# EAGLE design arduino_adapter (EAGLE 7.3.0)
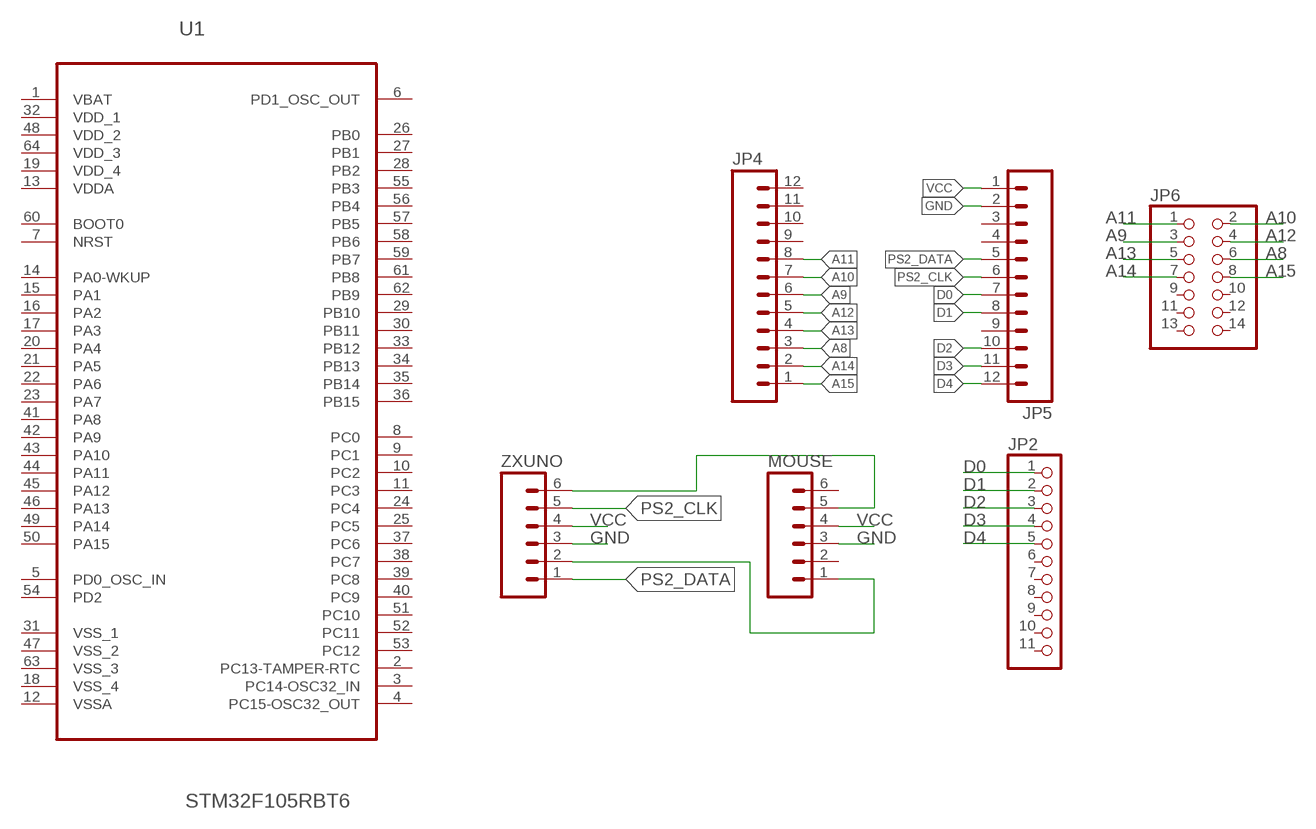
[diagram p0: schematic, sheet 1]

## Parts
JP2  PINHD-1X11  [1X11]
JP4  M12PTH  [1X12]
JP5  M12PTH  [1X12]
JP6  PINHD-2X7  [2X07]
MOUSE  DINC_MIN_TM_6_1  [DINC/MIN_TM/6_1PRIMARY]
U1  STM32F105RBT6  [QFP50P1200X1200X160-64N]
ZXUNO  DINC_MIN_TM_6_1  [DINC/MIN_TM/6_1PRIMARY]

## Nets
A8: JP4.3 JP6.6
A9: JP4.6 JP6.3
A10: JP4.7 JP6.2
A11: JP4.8 JP6.1
A12: JP4.5 JP6.4
A13: JP4.4 JP6.5
A14: JP4.2 JP6.7
A15: JP4.1 JP6.8
D0: JP2.1 JP5.7
D1: JP2.2 JP5.8
D2: JP2.3 JP5.10
D3: JP2.4 JP5.11
D4: JP2.5 JP5.12
GND: JP5.2 MOUSE.3 ZXUNO.3
N$1: MOUSE.5 ZXUNO.6
N$2: MOUSE.1 ZXUNO.2
PS2_CLK: JP5.6 ZXUNO.5
PS2_DATA: JP5.5 ZXUNO.1
VCC: JP5.1 MOUSE.4 ZXUNO.4
Unconnected: JP2.6 JP2.7 JP2.8 JP2.9 JP2.10 JP2.11 JP4.9 JP4.10 JP4.11 JP4.12 JP5.3 JP5.4 JP5.9 JP6.9 JP6.10 JP6.11 JP6.12 JP6.13 JP6.14 MOUSE.2 MOUSE.6 U1.2(PC13-TAMPER-RTC) U1.3(PC14-OSC32_IN) U1.4(PC15-OSC32_OUT) U1.5(PD0_OSC_IN) U1.6(PD1_OSC_OUT) U1.7(NRST) U1.8(PC0) U1.9(PC1) U1.10(PC2) U1.11(PC3) U1.14(PA0-WKUP) U1.15(PA1) U1.16(PA2) U1.17(PA3) U1.20(PA4) U1.21(PA5) U1.22(PA6) U1.23(PA7) U1.24(PC4) U1.25(PC5) U1.26(PB0) U1.27(PB1) U1.28(PB2) U1.29(PB10) U1.30(PB11) U1.33(PB12) U1.34(PB13) U1.35(PB14) U1.36(PB15) U1.37(PC6) U1.38(PC7) U1.39(PC8) U1.40(PC9) U1.41(PA8) U1.42(PA9) U1.43(PA10) U1.44(PA11) U1.45(PA12) U1.46(PA13) U1.49(PA14) U1.50(PA15) U1.51(PC10) U1.52(PC11) U1.53(PC12) U1.54(PD2) U1.55(PB3) U1.56(PB4) U1.57(PB5) U1.58(PB6) U1.59(PB7) U1.60(BOOT0) U1.61(PB8) U1.62(PB9)

## Power pins joined to a net without a drawn wire
VBAT: U1.1(VBAT)
VDD_1: U1.32(VDD_1)
VDD_2: U1.48(VDD_2)
VDD_3: U1.64(VDD_3)
VDD_4: U1.19(VDD_4)
VDDA: U1.13(VDDA)
VSS_1: U1.31(VSS_1)
VSS_2: U1.47(VSS_2)
VSS_3: U1.63(VSS_3)
VSS_4: U1.18(VSS_4)
VSSA: U1.12(VSSA)

## Library data of the parts
JP2 = pinhead:PINHD-1X11: PIN HEADER
JP4 JP5 = SparkFun-Connectors:M12: Header 12 Standard 12-pin 0.1" header. Use with straight break away headers (SKU : PRT-00116), right angle break away headers (PRT-00553), swiss pins (PRT-00743), machine pins (PRT-00117), and female headers (PRT-00115).
JP6 = pinhead:PINHD-2X7: PIN HEADER
MOUSE ZXUNO = ZX_UNO_0_14:DINC_MIN_TM_6_1
U1 = iwasz-logo:STM32F105RBT6: ARM-based 32-bit MCU; MPN: STM32F105RBT6; OC_FARNELL: 1737133; OC_NEWARK: 25R9437; PACKAGE: LQFP-64; SUPPLIER: STMicroelectronics

## Net classes
1 vcc: width 0.254 mm

## Board
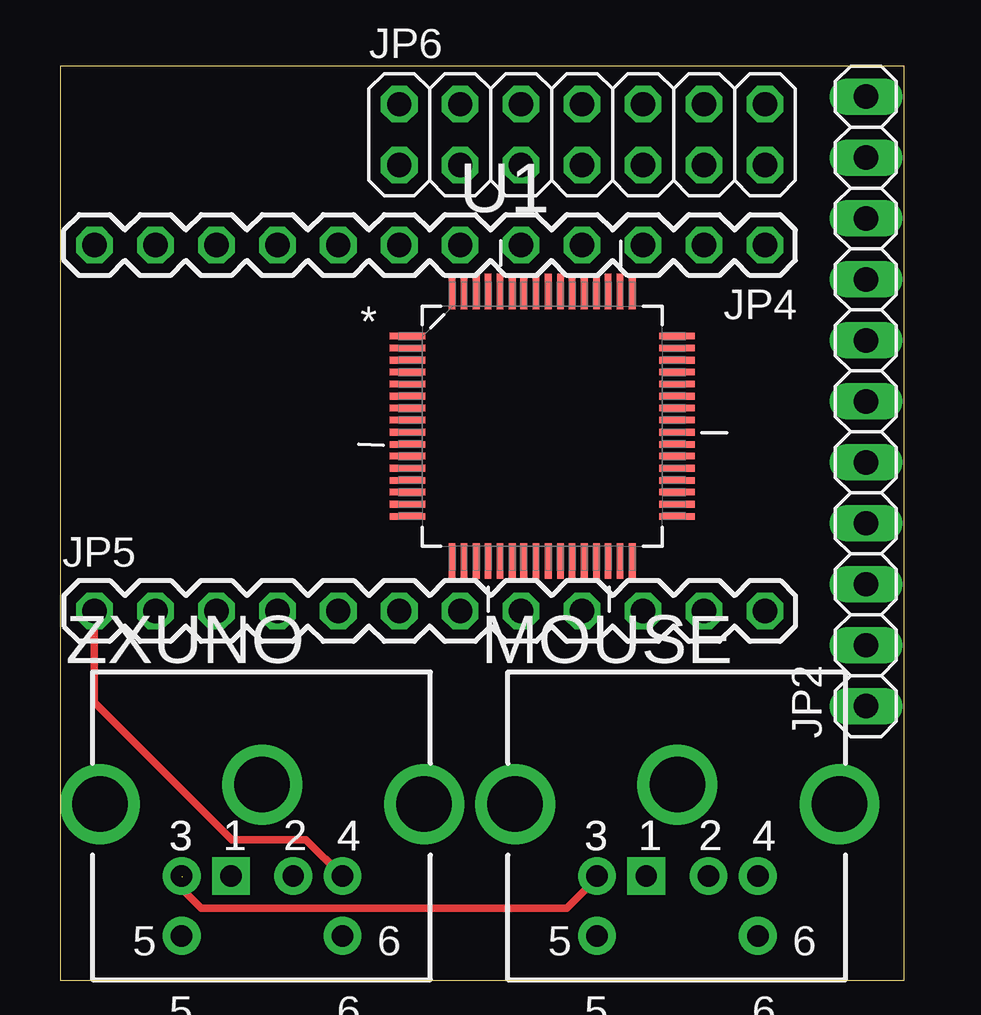
[diagram p1: board, top side]
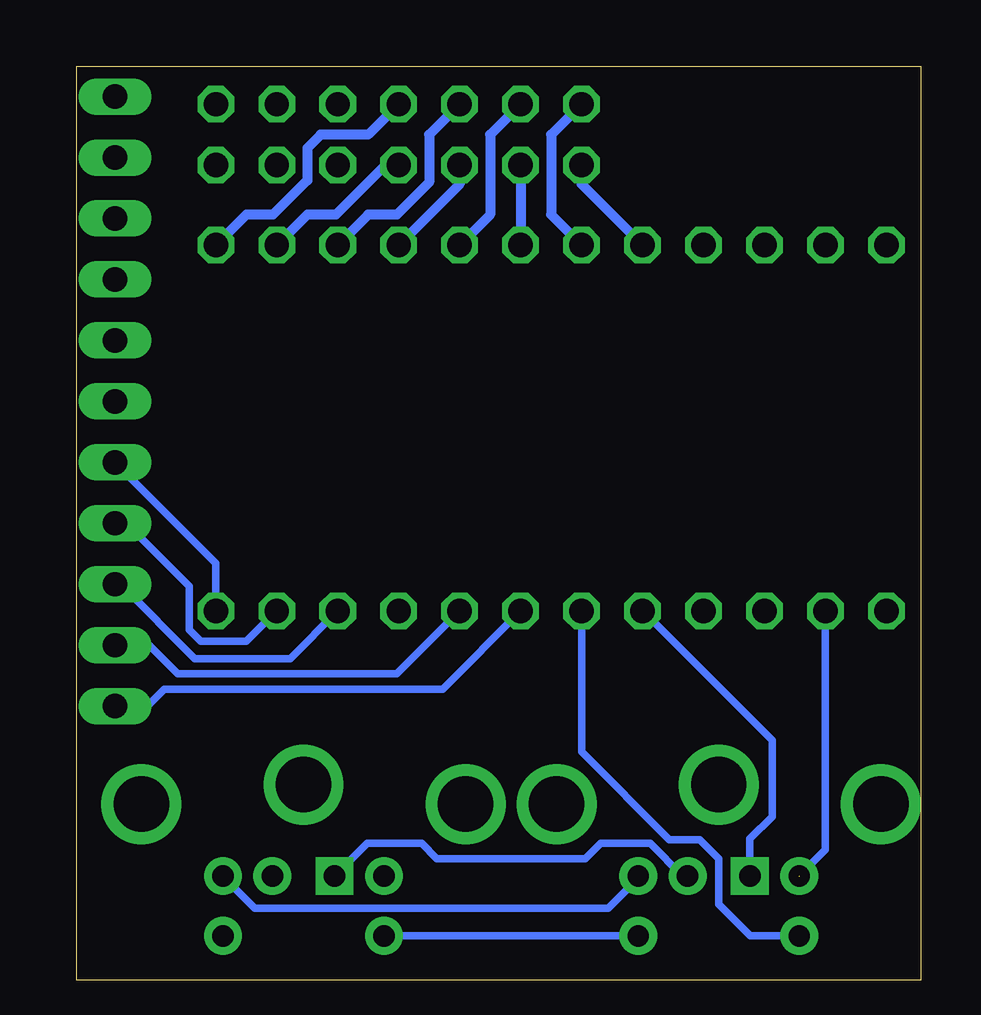
[diagram p2: board, bottom side, seen from below]

No outline drawn. Coordinates in mm, seen from the top.
Copper layers (1*16): Top 0.035mm / dielectric 1.5mm / Bottom 0.035mm
Design rules "default": minimum track width 10mil, minimum drill 24mil, track to track 8mil, track to pad 8mil, pad to pad 8mil, via to via 8mil, smd to smd 8mil, copper to edge 40mil, drill to drill 8mil, minimum pad ring 10mil, minimum via ring 8mil, stop-mask expansion 4mil, vias tented up to drill 0mil, thermal gap 10mil
Milling: 4 lines

### Footprints (pad centres in the part's own frame; a part is rotated, then mirrored left to right if it is on the bottom)
1X11 = drill 1.016 long: 1 -12.7,0; 2 -10.16,0; 3 -7.62,0; 4 -5.08,0; 5 -2.54,0; 6 0,0; 7 2.54,0; 8 5.08,0; 9 7.62,0; 10 10.16,0; 11 12.7,0
1X12 = drill 1.016 octagon: 1 0,0; 2 2.54,0; 3 5.08,0; 4 7.62,0; 5 10.16,0; 6 12.7,0; 7 15.24,0; 8 17.78,0; 9 20.32,0; 10 22.86,0; 11 25.4,0; 12 27.94,0
2X07 = drill 1.016 octagon: 1 -7.62,-1.27; 2 -7.62,1.27; 3 -5.08,-1.27; 4 -5.08,1.27; 5 -2.54,-1.27; 6 -2.54,1.27; 7 0,-1.27; 8 0,1.27; 9 2.54,-1.27; 10 2.54,1.27; 11 5.08,-1.27; 12 5.08,1.27; 13 7.62,-1.27; 14 7.62,1.27
DINC/MIN_TM/6_1PRIMARY = drill 0.889 pad 1.575 square: 1 -1.295,-8.509 | drill 0.889 pad 1.575: 2 1.295,-8.509; 3 -3.353,-8.509; 4 3.353,-8.509; 5 -3.353,-10.998; 6 3.353,-10.998 | drill 2.311 pad 2.845: 7 -6.756,-5.512; 8 0,-4.699; 9 6.756,-5.512
QFP50P1200X1200X160-64N = smd 1.473 x 0.279: 1 -5.613,3.759; 2 -5.613,3.251; 3 -5.613,2.743; 4 -5.613,2.261; 5 -5.613,1.753; 6 -5.613,1.245; 7 -5.613,0.762; 8 -5.613,0.254; 9 -5.613,-0.254; 10 -5.613,-0.762; 11 -5.613,-1.245; 12 -5.613,-1.753; 13 -5.613,-2.261; 14 -5.613,-2.743; 15 -5.613,-3.251; 16 -5.613,-3.759; 33 5.613,-3.759; 34 5.613,-3.251; 35 5.613,-2.743; 36 5.613,-2.261; 37 5.613,-1.753; 38 5.613,-1.245; 39 5.613,-0.762; 40 5.613,-0.254; 41 5.613,0.254; 42 5.613,0.762; 43 5.613,1.245; 44 5.613,1.753; 45 5.613,2.261; 46 5.613,2.743; 47 5.613,3.251; 48 5.613,3.759 | smd 0.279 x 1.473: 17 -3.759,-5.613; 18 -3.251,-5.613; 19 -2.743,-5.613; 20 -2.261,-5.613; 21 -1.753,-5.613; 22 -1.245,-5.613; 23 -0.762,-5.613; 24 -0.254,-5.613; 25 0.254,-5.613; 26 0.762,-5.613; 27 1.245,-5.613; 28 1.753,-5.613; 29 2.261,-5.613; 30 2.743,-5.613; 31 3.251,-5.613; 32 3.759,-5.613; 49 3.759,5.613; 50 3.251,5.613; 51 2.743,5.613; 52 2.261,5.613; 53 1.753,5.613; 54 1.245,5.613; 55 0.762,5.613; 56 0.254,5.613; 57 -0.254,5.613; 58 -0.762,5.613; 59 -1.245,5.613; 60 -1.753,5.613; 61 -2.261,5.613; 62 -2.743,5.613; 63 -3.251,5.613; 64 -3.759,5.613

### Placement (x,y rotation side)
JP2  33.58,24.13 90 top
JP4  29.37,30.64 180 top
JP5  1.43,15.4 0 top
JP6  21.75,35.24 0 top
MOUSE  25.72,12.86 0 top
U1  20.08,23.1 0 top
ZXUNO  8.41,12.86 0 top

### Tracks (layer width: path | path; a pad name or v marks a point on that pad's centre or on a via)
A8
  Bottom 0.406: JP6.6 20.48,35.24 20.48,33.26 21.83,31.91 23.02,31.91 JP4.3
A9
  Bottom 0.406: JP6.3 JP4.6
A10
  Bottom 0.406: JP6.2 15.4,35.24 15.4,31.91 JP4.7
A11
  Bottom 0.406: JP6.1 14.13,33.18 JP4.8
A12
  Bottom 0.406: JP6.4 17.94,35.24 17.94,31.91 JP4.5
A13
  Bottom 0.406: JP6.5 19.21,33.18 JP4.4
A14
  Bottom 0.406: JP6.7 22.3,33.97 24.37,31.91 25.56,31.91 JP4.2
A15
  Bottom 0.406: JP6.8 23.02,35.24 25,35.24 25.56,34.69 25.56,33.34 26.99,31.91 28.1,31.91 JP4.1
D0
  Bottom 0.305: JP5.7 19.92,12.14 31.51,12.14 32.15,11.51 33.5,11.51 JP2.1
D1
  Bottom 0.305: JP5.8 21.83,12.78 30.96,12.78 32.15,13.97 JP2.2
D2
  Bottom 0.305: JP5.10 26.27,13.41 30.24,13.41 33.34,16.51 JP2.3
D3
  Bottom 0.305: JP5.11 28.1,14.13 30,14.13 30.48,14.61 30.48,16.43 33.1,19.05 JP2.4
D4
  Bottom 0.305: JP5.12 29.37,17.38 JP2.5
GND  (1 unrouted)
  Top 0.305: MOUSE.3 22.36,4.27 21.11,3.02 5.87,3.02 5.08,3.81 5.08,4.33
  Bottom 0.305: 3.97,15.48 JP5.2 3.97,5.44 ZXUNO.3
N$1
  Bottom 0.305: ZXUNO.6 MOUSE.5
N$2
  Bottom 0.305: ZXUNO.2 9.91,4.35 11.27,5.71 13.34,5.71 13.97,5.08 20.16,5.08 20.8,5.71 23.06,5.71 MOUSE.1
PS2_CLK
  Bottom 0.305: ZXUNO.5 7.1,1.86 8.41,3.17 8.41,5.08 9.21,5.87 10.48,5.87 14.13,9.53 JP5.6
PS2_DATA
  Bottom 0.305: ZXUNO.1 7.12,5.9 6.19,6.83 6.19,10 JP5.5
VCC
  Top 0.305: ZXUNO.4 10.24,5.87 7.14,5.87 1.43,11.59 JP5.1
  Bottom 0.305: ZXUNO.4 11.77,4.27 13.02,3.02 27.74,3.02 MOUSE.4